# EAGLE design xilinx_platform_cable_iii (EAGLE 6.4)
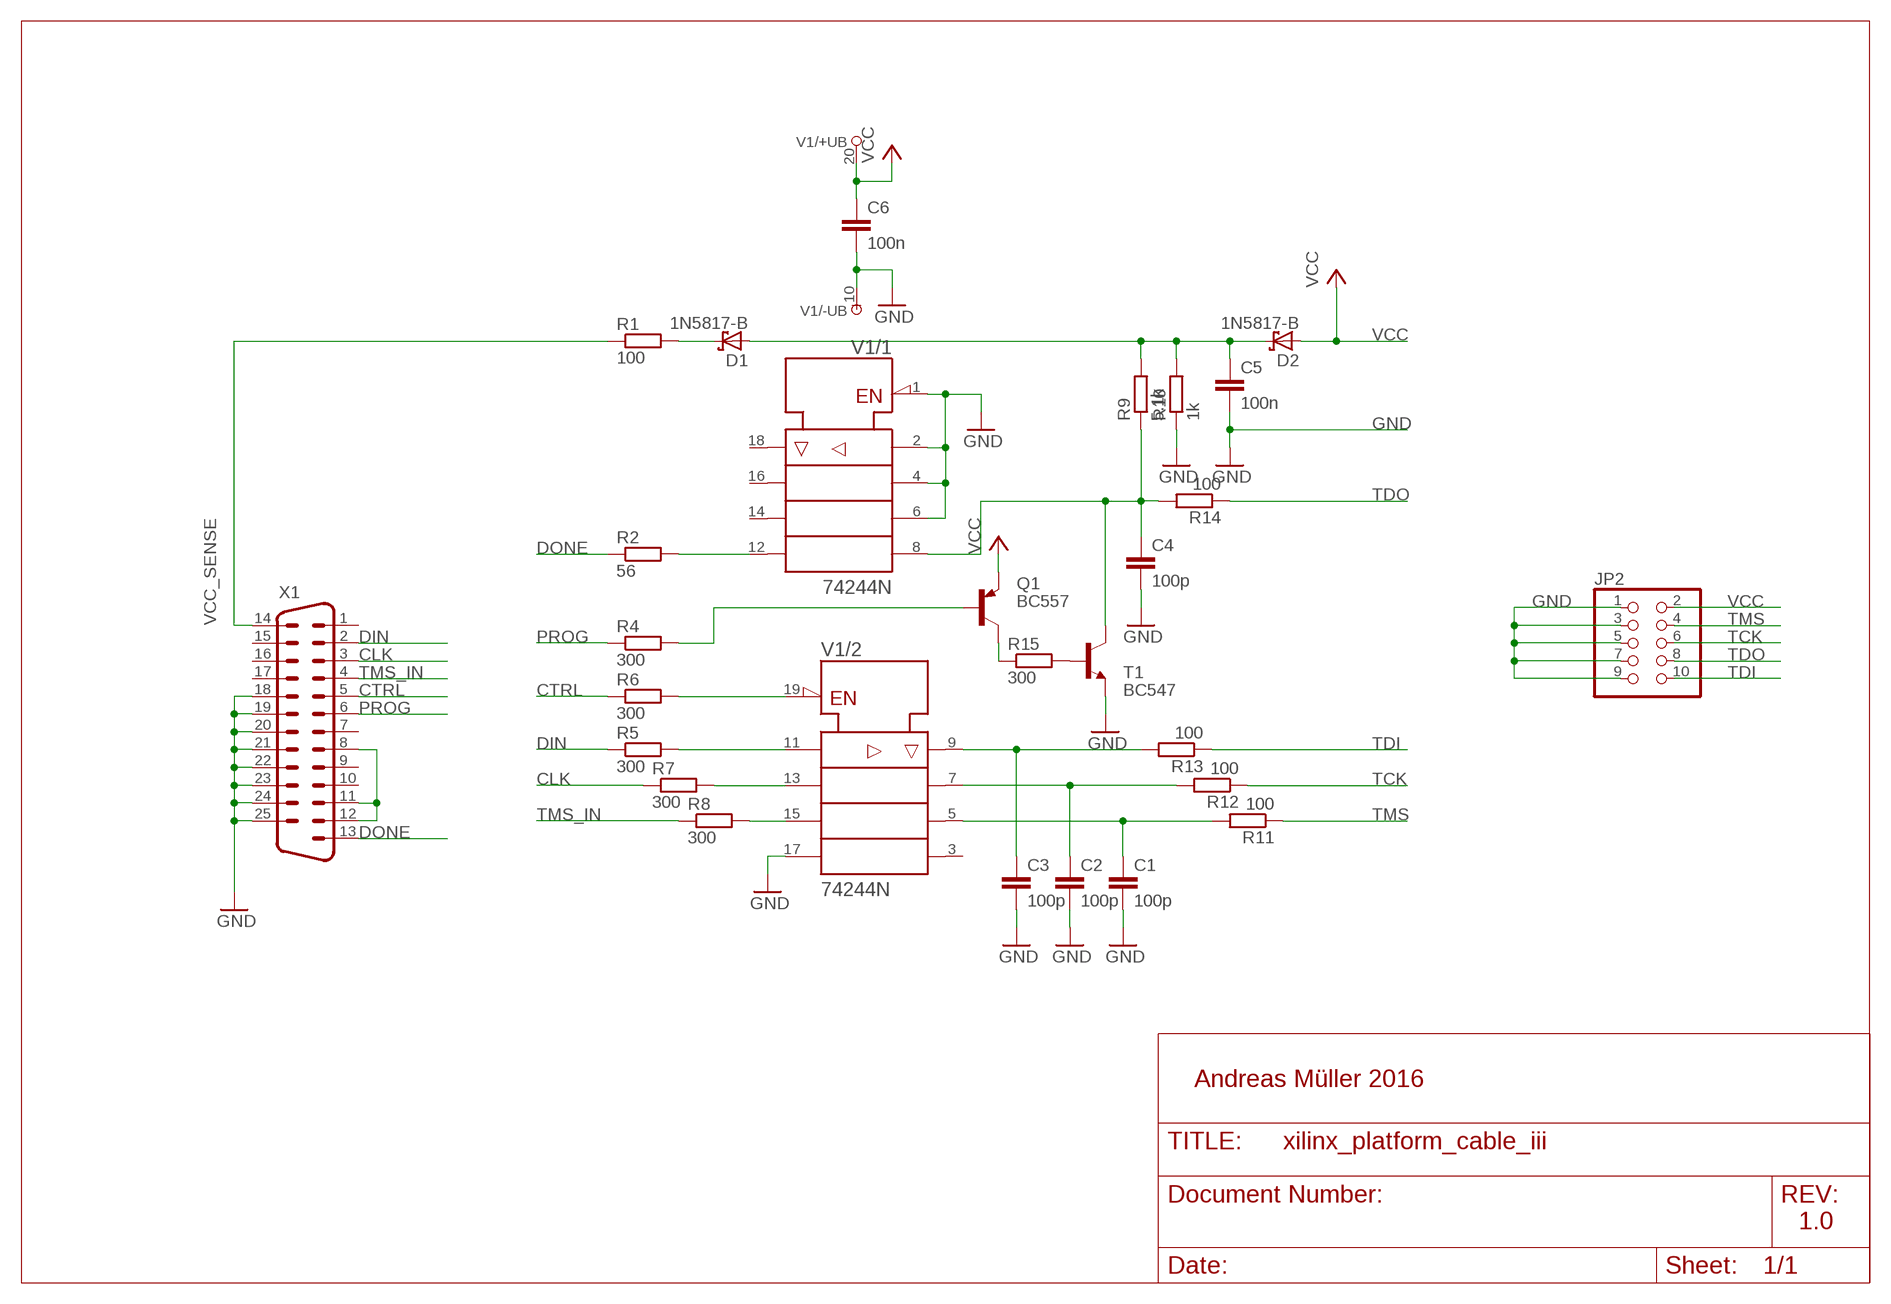
[diagram p0: schematic, sheet 1]

## Parts
C1  100p  C-EU025-030X050  [C025-030X050]
C2  100p  C-EU025-030X050  [C025-030X050]
C3  100p  C-EU025-030X050  [C025-030X050]
C4  100p  C-EU025-030X050  [C025-030X050]
C5  100n  C-EU025-030X050  [C025-030X050]
C6  100n  C-EU025-030X050  [C025-030X050]
D1  1N5817-B  [DO41-7.6]
D2  1N5817-B  [DO41-7.6]
JP2  PINHD-2X5  [2X05]
Q1  BC557  [TO92]
R1  100  R-EU_0207/12  [0207/12]
R2  56  R-EU_0207/12  [0207/12]
R4  300  R-EU_0207/12  [0207/12]
R5  300  R-EU_0207/12  [0207/12]
R6  300  R-EU_0207/12  [0207/12]
R7  300  R-EU_0207/12  [0207/12]
R8  300  R-EU_0207/12  [0207/12]
R9  5.1k  R-EU_0207/12  [0207/12]
R10  1k  R-EU_0207/12  [0207/12]
R11  100  R-EU_0207/12  [0207/12]
R12  100  R-EU_0207/12  [0207/12]
R13  100  R-EU_0207/12  [0207/12]
R14  100  R-EU_0207/12  [0207/12]
R15  300  R-EU_0207/12  [0207/12]
T1  BC547  [TO92]
V1  74244N  [DIL20]
X1  DB25HP  [M25HP]

## Nets
CLK: R7.1 X1.3
CTRL: R6.1 X1.5
DIN: R5.1 X1.2
DONE: R2.1 X1.13
GND: C1.2 C2.2 C3.2 C4.2 C5.2 C6.2 JP2.1 JP2.3 JP2.5 JP2.7 JP2.9 R10.1 T1.1(E) V1.1(/1:!G) V1.2(/1:A1) V1.4(/1:A2) V1.6(/1:A3) V1.10(/-UB:-UB) V1.17(/2:A4) X1.18 X1.19 X1.20 X1.21 X1.22 X1.23 X1.24 X1.25
N$1: Q1.3(C) R15.1
N$2: R15.2 T1.2(B)
N$4: X1.8 X1.11 X1.12
N$5: Q1.2(B) R4.2
N$9: D1.C R1.2
N$10: R2.2 V1.12(/1:Y4)
N$11: R6.2 V1.19(/2:!G)
N$12: R7.2 V1.13(/2:A2)
N$13: R8.2 V1.15(/2:A3)
N$14: R5.2 V1.11(/2:A1)
N$15: C5.1 D1.A D2.C R9.2 R10.2
N$17: C3.1 R13.2 V1.9(/2:Y1)
N$18: C2.1 R12.2 V1.7(/2:Y2)
N$19: C1.1 R11.2 V1.5(/2:Y3)
N$20: C4.1 R9.1 R14.2 T1.3(C) V1.8(/1:A4)
PROG: R4.1 X1.6
TCK: JP2.6 R12.1
TDI: JP2.10 R13.1
TDO: JP2.8 R14.1
TMS: JP2.4 R11.1
TMS_IN: R8.1 X1.4
VCC: C6.1 D2.A JP2.2 Q1.1(E) V1.20(/+UB:+UB)
VCC_SENSE: R1.1 X1.14
Unconnected: V1.3(/2:Y4) V1.14(/1:Y3) V1.16(/1:Y2) V1.18(/1:Y1) X1.1 X1.7 X1.9 X1.10 X1.15 X1.16 X1.17

## Notes on the sheet
- Andreas Müller 2016
- 1.0

## Library data of the parts
C1-C6 = rcl:C-EU: CAPACITOR, European symbol
D1 D2 = diode:1N581*: 1.0A SCHOTTKY BARRIER RECTIFIER Source: http://www.diodes.com/datasheets/ds23001.pdf
JP2 = pinhead:PINHD-2X5: PIN HEADER
Q1 = transistor-pnp:BC557: PNP Transistor
R1 R2 R4-R15 = rcl:R-EU_: RESISTOR, European symbol
T1 = transistor:BC547: NPN TRANSISTOR
V1 = 74ttl-din:74*244: Octal BUFFER and LINE DRIVER, 3-state
X1 = SparkFun-Connectors:DB25: Various DB25 connectors

## Board
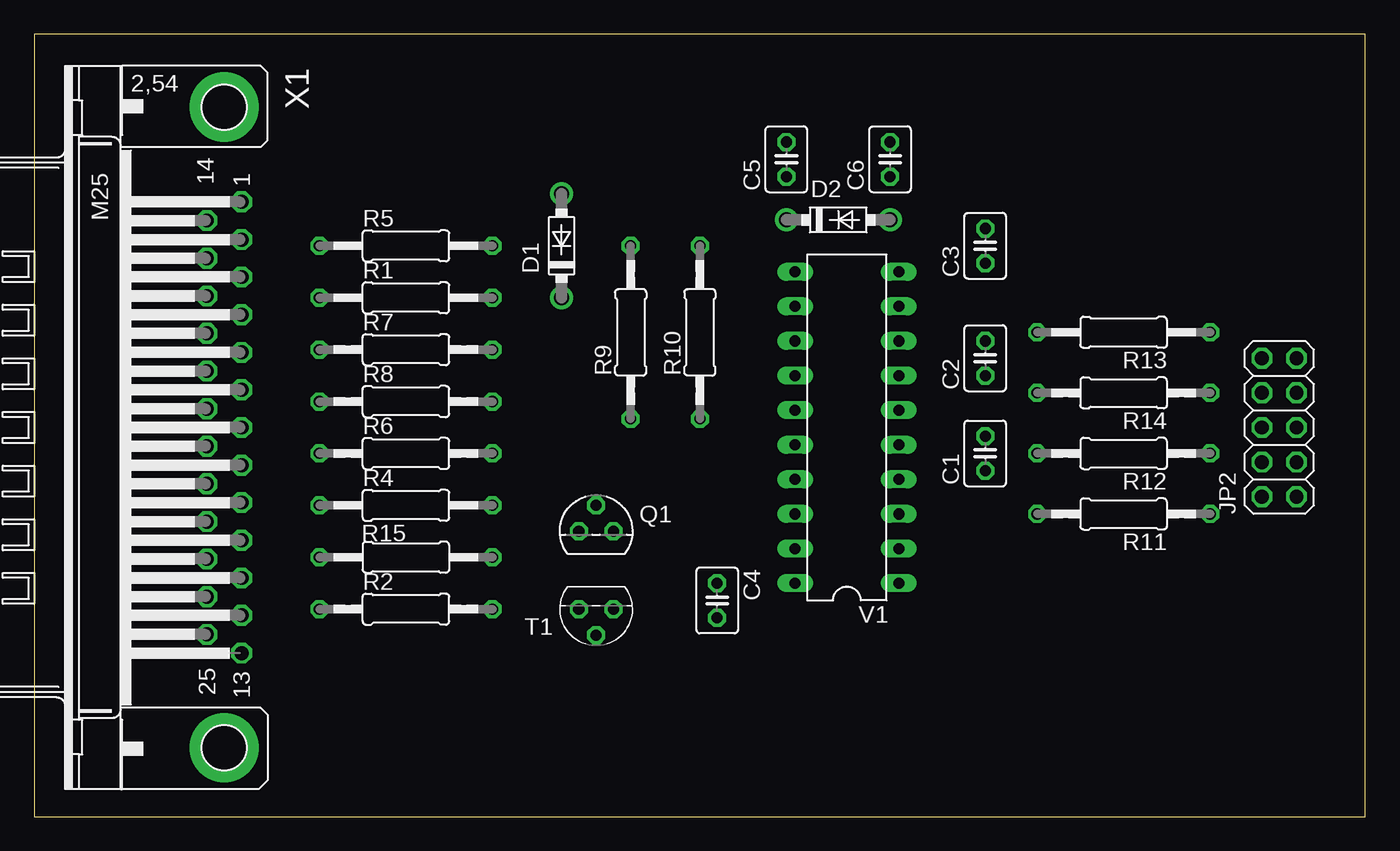
[diagram p1: board, top side]
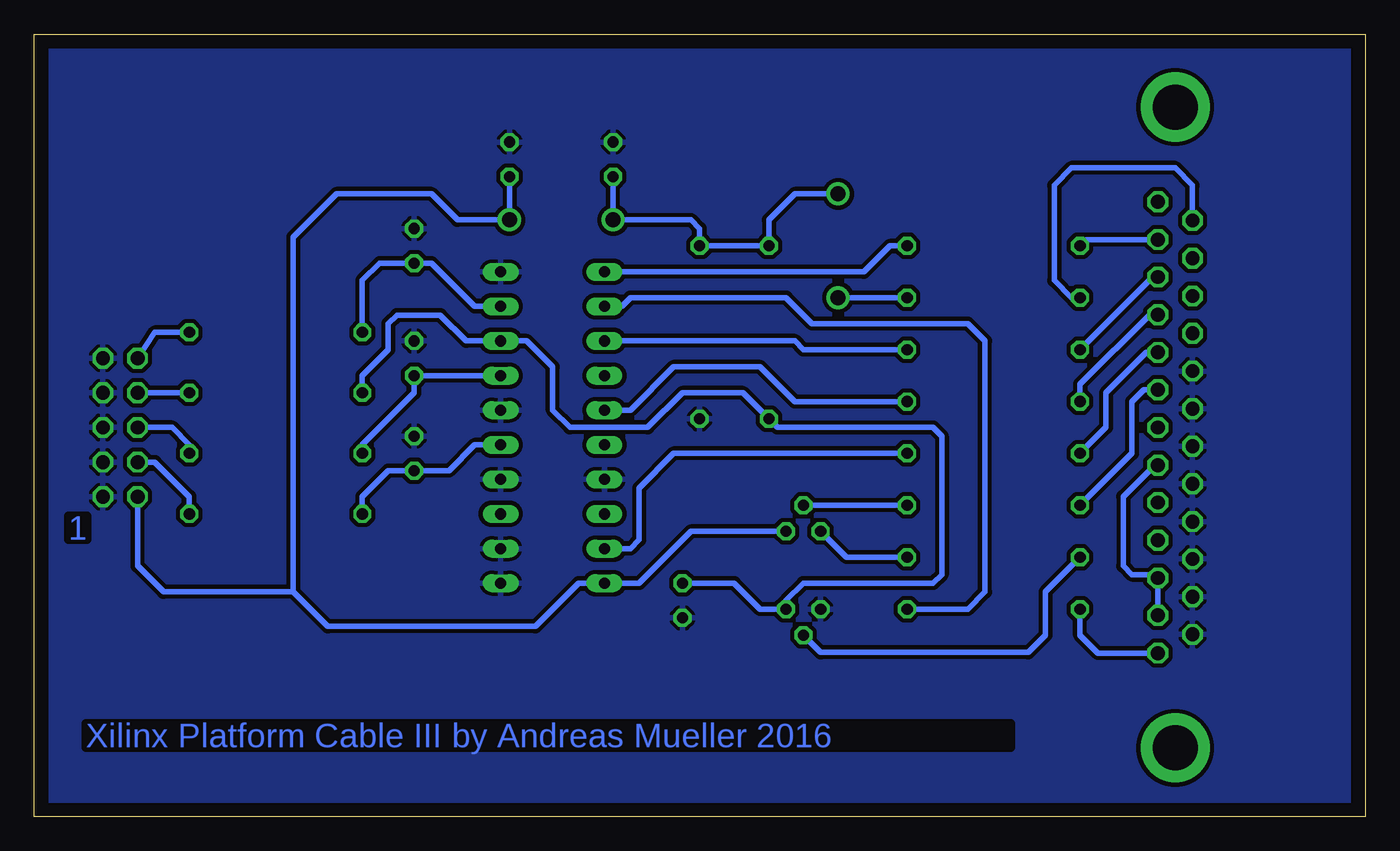
[diagram p2: board, bottom side, seen from below]

Size 97.77 x 57.45 mm. Coordinates in mm from the lower left corner, seen from the top.
Outline: 0,0 97.77,0 97.77,57.45 0,57.45 0,0
Copper layers (1*16): Top 0.035mm / dielectric 1.5mm / Bottom 0.035mm
Design rules "default *": minimum track width 10mil, minimum drill 24mil, track to track 12mil, track to pad 12mil, pad to pad 12mil, via to via 12mil, smd to smd 12mil, copper to edge 40mil, drill to drill 8mil, minimum pad ring 10mil, minimum via ring 8mil, stop-mask expansion 4mil, vias tented up to drill 0mil, thermal gap 10mil

### Footprints (pad centres in the part's own frame; a part is rotated, then mirrored left to right if it is on the bottom)
C025-030X050 = drill 0.813 octagon: 1 -1.27,0; 2 1.27,0
DO41-7.6 = drill 1.1 pad 1.7: A 3.81,0; C -3.81,0
2X05 = drill 1.016 octagon: 1 -5.08,-1.27; 2 -5.08,1.27; 3 -2.54,-1.27; 4 -2.54,1.27; 5 0,-1.27; 6 0,1.27; 7 2.54,-1.27; 8 2.54,1.27; 9 5.08,-1.27; 10 5.08,1.27
TO92 = drill 0.813 octagon: 1 1.27,0; 2 0,1.905; 3 -1.27,0
0207/12 = drill 0.813 octagon: 1 -6.35,0; 2 6.35,0
DIL20 = drill 0.813 long: 1 -11.43,-3.81; 2 -8.89,-3.81; 3 -6.35,-3.81; 4 -3.81,-3.81; 5 -1.27,-3.81; 6 1.27,-3.81; 7 3.81,-3.81; 8 6.35,-3.81; 9 8.89,-3.81; 10 11.43,-3.81; 11 11.43,3.81; 12 8.89,3.81; 13 6.35,3.81; 14 3.81,3.81; 15 1.27,3.81; 16 -1.27,3.81; 17 -3.81,3.81; 18 -6.35,3.81; 19 -8.89,3.81; 20 -11.43,3.81
M25HP = drill 1.016 octagon: 1 -16.561,1.27; 2 -13.792,1.27; 3 -11.049,1.27; 4 -8.28,1.27; 5 -5.512,1.27; 6 -2.769,1.27; 7 0,1.27; 8 2.769,1.27; 9 5.512,1.27; 10 8.28,1.27; 11 11.049,1.27; 12 13.792,1.27; 13 16.561,1.27; 14 -15.189,-1.27; 15 -12.421,-1.27; 16 -9.652,-1.27; 17 -6.909,-1.27; 18 -4.14,-1.27; 19 -1.372,-1.27; 20 1.372,-1.27; 21 4.14,-1.27; 22 6.909,-1.27; 23 9.652,-1.27; 24 12.421,-1.27; 25 15.189,-1.27 | drill 3.302 pad 5.08: G1 -23.52,0; G2 23.52,0

### Placement (x,y rotation side)
C1  69.85,26.67 90 top
C2  69.85,33.66 90 top
C3  69.85,41.91 90 top
C4  50.16,15.88 270 top
C5  55.24,48.26 90 top
C6  62.87,48.26 90 top
D1  38.73,41.91 90 top
D2  59.05,43.81 0 top
JP2  91.44,28.57 90 top
Q1  41.27,20.95 0 top
R1  27.3,38.1 0 top
R2  27.3,15.24 0 top
R4  27.3,22.86 0 top
R5  27.3,41.91 0 top
R6  27.3,26.67 0 top
R7  27.3,34.29 0 top
R8  27.3,30.48 0 top
R9  43.81,35.56 90 top
R10  48.9,35.56 90 top
R11  80.01,22.23 180 top
R12  80.01,26.67 180 top
R13  80.01,35.56 180 top
R14  80.01,31.11 180 top
R15  27.3,19.05 180 top
T1  41.27,15.24 180 top
V1  59.69,28.57 90 top
X1  13.97,28.57 270 top

### Tracks (layer width: path | path; a pad name or v marks a point on that pad's centre or on a via)
CLK
  Bottom 0.406: X1.3 15.62,39.62 R7.1
CTRL
  Bottom 0.406: X1.5 16.08,34.09 19.05,31.11 19.05,28.57 R6.1
DIN
  Bottom 0.406: X1.2 20.5,42.37 R5.1
DONE
  Bottom 0.406: X1.13 19.63,12.01 20.95,13.34 R2.1
GND
  pour Bottom: 1.27,56.52 96.52,56.52 96.52,0.64 1.27,0.64
N$1
  Bottom 0.406: R15.1 38.1,19.05 Q1.3
N$2
  Bottom 0.406: T1.2 40.01,12.06 24.77,12.06 23.5,13.34 23.5,16.51 R15.2
N$4
  Bottom 0.406: X1.8 15.47,25.81 17.78,23.5 17.78,18.41 17.14,17.78 15.49,17.78 X1.11 X1.12
N$5
  Bottom 0.406: R4.2 Q1.2
N$9
  Bottom 0.406: R1.2 D1.C
N$10
  Bottom 0.406: V1.12 54.61,37.47 53.98,38.1 42.55,38.1 40.64,36.2 29.21,36.2 27.94,34.92 27.94,16.51 29.21,15.24 R2.2
N$11
  Bottom 0.406: R6.2 50.8,26.67 53.34,24.13 53.34,20.32 53.98,19.68 V1.19
N$12
  Bottom 0.406: R7.2 41.27,34.29 41.91,34.92 V1.13
N$13
  Bottom 0.406: R8.2 41.91,30.48 44.45,33.02 50.8,33.02 53.98,29.84 V1.15
N$14
  Bottom 0.406: R5.2 34.92,41.91 36.83,40.01 V1.11
N$15
  Bottom 0.406: C5.1 D2.C 49.53,43.81 48.9,43.18 R10.2 R9.2 43.81,43.81 41.91,45.72 D1.A
N$17
  Bottom 0.406: V1.9 65.41,37.47 68.58,40.64 C3.1 72.39,40.64 73.66,39.37 R13.2
N$18
  Bottom 0.406: V1.7 C2.1 69.85,31.11 73.66,27.3 R12.2
N$19
  Bottom 0.406: V1.5 65.41,27.3 67.31,25.4 C1.1 71.75,25.4 73.66,23.5 R11.2
N$20
  Bottom 0.406: C4.1 46.35,17.14 44.45,15.24 T1.3 42.55,15.88 41.27,17.14 31.75,17.14 31.11,17.78 31.11,27.94 31.75,28.57 43.18,28.57 R9.1 45.72,31.11 50.16,31.11 52.7,28.57 58.42,28.57 59.69,29.84 59.69,33.02 61.59,34.92 V1.8 66.04,34.92 67.94,36.83 71.12,36.83 71.75,36.2 71.75,34.29 73.66,32.38 R14.2
PROG
  Bottom 0.406: X1.6 16.28,31.34 17.14,30.48 17.14,26.67 R4.1
TCK
  Bottom 0.406: R12.1 86.36,27.3 87.63,28.57 JP2.6
TDI
  Bottom 0.406: R13.1 88.9,35.56 JP2.10
TDO
  Bottom 0.406: R14.1 JP2.8
TMS
  Bottom 0.406: JP2.4 88.9,26.04 86.36,23.5 R11.1
TMS_IN
  Bottom 0.406: X1.4 15.85,36.85 20.95,31.75 R8.1
VCC
  Bottom 0.406: C6.1 D2.A 66.67,43.81 68.58,45.72 75.56,45.72 78.74,42.55 78.74,16.51 | 78.74,16.51 76.2,13.97 60.96,13.97 57.78,17.14 V1.20 53.34,17.14 49.53,20.95 Q1.1 | 78.74,16.51 88.27,16.51 90.17,18.41 JP2.2
VCC_SENSE
  Bottom 0.406: X1.14 12.7,46.35 13.97,47.62 21.59,47.62 22.86,46.35 22.86,39.37 21.59,38.1 R1.1

### Text on the board
Bottom: 1 | Xilinx Platform Cable III by Andreas Mueller 2016